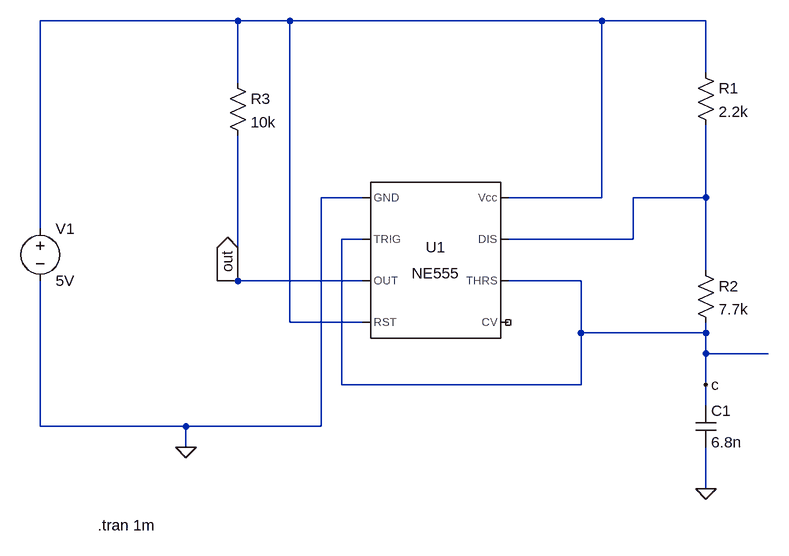
[diagram p0: schematic Timer555ForAstableOperation.asc]
Timer555ForAstableOperation.asc, the LTspice schematic file:
Version 4
SHEET 1 916 760
WIRE 96 -32 -208 -32
WIRE 176 -32 96 -32
WIRE 656 -32 176 -32
WIRE 816 -32 656 -32
WIRE 816 48 816 -32
WIRE 96 64 96 -32
WIRE 288 240 224 240
WIRE 656 240 656 -32
WIRE 656 240 512 240
WIRE 816 240 816 128
WIRE 816 240 704 240
WIRE -208 288 -208 -32
WIRE 288 304 256 304
WIRE 704 304 704 240
WIRE 704 304 512 304
WIRE 816 352 816 240
WIRE 80 368 64 368
WIRE 96 368 96 144
WIRE 96 368 80 368
WIRE 288 368 96 368
WIRE 624 368 512 368
WIRE 176 432 176 -32
WIRE 288 432 176 432
WIRE 624 448 624 368
WIRE 816 448 816 432
WIRE 816 448 624 448
WIRE 816 480 816 448
WIRE 912 480 816 480
WIRE 256 528 256 304
WIRE 624 528 624 448
WIRE 624 528 256 528
WIRE 816 528 816 480
WIRE 816 560 816 528
WIRE -208 592 -208 368
WIRE 16 592 -208 592
WIRE 224 592 224 240
WIRE 224 592 16 592
WIRE 16 624 16 592
WIRE 816 688 816 624
FLAG 16 624 0
FLAG 816 688 0
FLAG 80 368 out
IOPIN 80 368 Out
FLAG 816 528 c
SYMBOL NE555 400 336 R0
SYMATTR InstName U1
SYMBOL voltage -208 272 R0
SYMATTR InstName V1
SYMATTR Value 5V
SYMBOL res 800 32 R0
SYMATTR InstName R1
SYMATTR Value 2.2k
SYMBOL res 800 336 R0
SYMATTR InstName R2
SYMATTR Value 7.7k
SYMBOL res 80 48 R0
SYMATTR InstName R3
SYMATTR Value 10k
SYMBOL cap 800 560 R0
SYMATTR InstName C1
SYMATTR Value 6.8n
TEXT -120 744 Left 2 !.tran 1m

The netlist it stands for:
* Timer555ForAstableOperation.asc
XU1 0 c out N001 NC_01 c N002 N001 NE555  ; pins GND TRIG OUT RST CV THRS DIS Vcc
V1 N001 0 5V
R1 N001 N002 2.2k
R2 N002 c 7.7k
R3 N001 out 10k
C1 c 0 6.8n
.tran 1m
.lib NE555.sub
.backanno
.end